# Altium schematic sheet LoRaUNO_SCH_2022-06-21.schdoc
size 315 x 275 mm
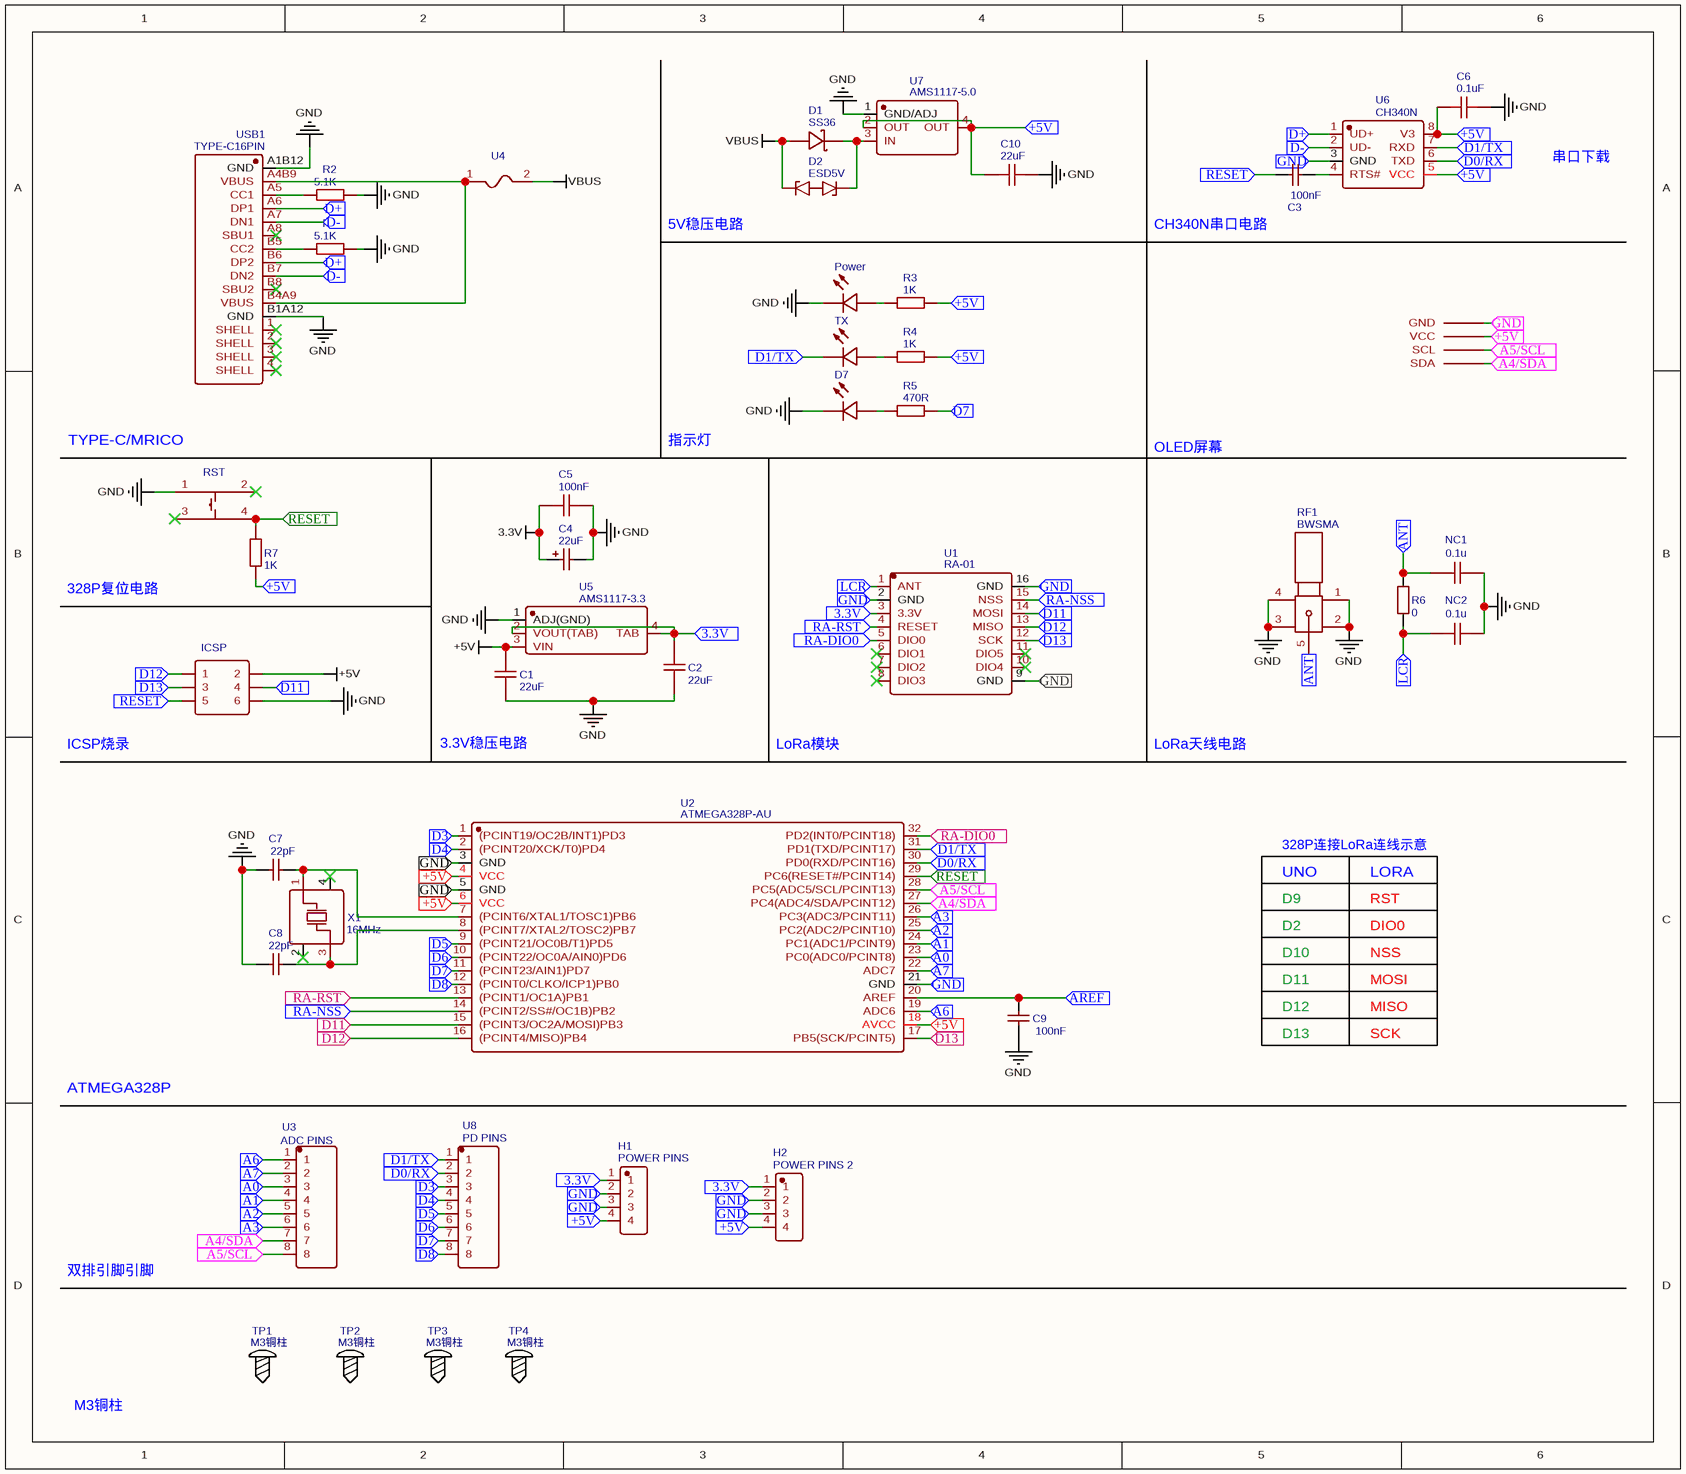
[diagram p0: LoRaUNO_SCH_2022-06-21.schdoc]

## Parts
A1  0.96 OLED  [0.96_I2C_OLED_SSD1306 NO HOLES]  (value not drawn)
C1  22uF  [C0603]
C2  22uF  [C0603]
C3  100nF  [C0603]
C4  22uF  [CAP-SMD_L3.5-W2.8-R-RD]
C5  100nF  [C0603]
C6  0.1uF  [C0603]
C7  22pF  [C0603]
C8  22pF  [C0603]
C9  100nF  [C0603]
C10  22uF  [C0603]
D1  SS36  [SMA_L4.3-W2.6-LS5.2-RD]
D2  ESD5V  [SOD-323_L1.8-W1.3-LS2.5-RD]
H1  POWER PINS  [HDR-TH_4P-P2.54-V-F]
H2  POWER PINS 2  [HDR-TH_4P-P2.54-V-F]
ICSP  Header-Male-2.54_2x3  [HDR-TH_6P-P2.54-V-R2-C3-S2.54]  (value not drawn)
LED1  Power  [LED0603-R-RD]
LED2  TX  [LED0603-R-RD]
LED3  D7  [LED0603-R-RD]
NC1  0.1u  [C0603]
NC2  0.1u  [C0603]
R1  5.1K  [R0603]
R2  5.1K  [R0603]
R3  1K  [R0603]
R4  1K  [R0603]
R5  470R  [R0603]
R6  0  [R0603]
R7  1K  [R0603]
RF1  BWSMA  [SMA-SMD_BWSMA-KE-P001]
RST  SKRPACE010  [KEY-SMD_4P-L4.2-W3.2-P2.20-LS4.6]  (value not drawn)
TP1  M3铜柱  [M3铜柱]
TP2  M3铜柱  [M3铜柱]
TP3  M3铜柱  [M3铜柱]
TP4  M3铜柱  [M3铜柱]
U1  RA-01  [WIRELM-SMD_RA-01]
U2  ATMEGA328P-AU  [TQFP-32_L7.0-W7.0-P0.80-LS9.0-BL]
U3  ADC PINS  [HDR-TH_8P-P2.54-V-M]
U4  MF-PSMF110X-2  [F0805]  (value not drawn)
U5  AMS1117-3.3  [SOT-223_L6.7-W3.5-P2.30-BR]
U6  CH340N  [SOP-8_L5.0-W4.0-P1.27-LS6.0-BL]
U7  AMS1117-5.0  [SOT-223-3_L6.5-W3.4-P2.30-LS7.0-BR]
U8  PD PINS  [HDR-TH_8P-P2.54-V-M]
USB1  TYPE-C16PIN  [USB-C-SMD_TYPE-C16PIN]
X1  16MHz  [OSC-SMD_4P-L3.2-W2.5-BL]

## Ports
3.3V (in), +5V (in), A0 (in), A1 (in), A2 (in), A3 (in), A4/SDA (in), A5/SCL (in), A6 (in), A7 (in), ANT (in), AREF (in), D0/RX (in), D1/TX (in), D3 (in), D4 (in), D5 (in), D6 (in), D7 (in), D8 (in), D11 (in), D12 (in), D13 (in), D+ (in), D- (in), GND (in), LCR (in), RA-DIO0 (in), RA-NSS (in), RA-RST (in), RESET (in)

## Nets
3.3V: C4.1 C5.1
+5V: C1.2 ICSP.2 U5.3(VIN)
GND: C1.1 C2.1 C4.2 C5.2 C6.2 C7.1 C8.1 C9.2 C10.1 ICSP.6 LED1.2 LED3.2 NC1.2 NC2.2 R1.1 R2.1 RF1.1 RF1.2 RF1.3 RF1.4 RST.1 U5.1(ADJ(GND)) U7.1(GND/ADJ) USB1.A1B12(GND) USB1.B1A12(GND)
VBUS: D1.2(A) D2.2 U4.2
3.3V: C2.2 H1.1 H2.1 U1.3(3.3V) U5.2(VOUT(TAB)) U5.4(TAB) ; port 3.3V  [a separate net that carries the same name]
+5V: A1.2(VCC) C6.1 C10.2 H1.4 H2.4 R3.2 R4.2 R7.1 U2.4(VCC) U2.6(VCC) U2.18(AVCC) U6.5(VCC) U6.8(V3) U7.2(OUT) U7.4(OUT) ; port +5V  [a separate net that carries the same name]
A0: U2.23(PC0(ADC0/PCINT8)) U3.3 ; port A0
A1: U2.24(PC1(ADC1/PCINT9)) U3.4 ; port A1
A2: U2.25(PC2(ADC2/PCINT10)) U3.5 ; port A2
A3: U2.26(PC3(ADC3/PCINT11)) U3.6 ; port A3
A4/SDA: A1.4(SDA) U2.27(PC4(ADC4/SDA/PCINT12)) U3.7 ; port A4/SDA
A5/SCL: A1.3(SCL) U2.28(PC5(ADC5/SCL/PCINT13)) U3.8 ; port A5/SCL
A6: U2.19(ADC6) U3.1 ; port A6
A7: U2.22(ADC7) U3.2 ; port A7
ANT: NC1.1 R6.2 RF1.5 ; port ANT
AREF: C9.1 U2.20(AREF) ; port AREF
D0/RX: U2.30(PD0(RXD/PCINT16)) U6.6(TXD) U8.2 ; port D0/RX
D1/TX: LED2.2 U2.31(PD1(TXD/PCINT17)) U6.7(RXD) U8.1 ; port D1/TX
D3: U2.1((PCINT19/OC2B/INT1)PD3) U8.3 ; port D3
D4: U2.2((PCINT20/XCK/T0)PD4) U8.4 ; port D4
D5: U2.9((PCINT21/OC0B/T1)PD5) U8.5 ; port D5
D6: U2.10((PCINT22/OC0A/AIN0)PD6) U8.6 ; port D6
D7: R5.2 U2.11((PCINT23/AIN1)PD7) U8.7 ; port D7
D8: U2.12((PCINT0/CLKO/ICP1)PB0) U8.8 ; port D8
D11: ICSP.4 U1.14(MOSI) U2.15((PCINT3/OC2A/MOSI)PB3) ; port D11
D12: ICSP.1 U1.13(MISO) U2.16((PCINT4/MISO)PB4) ; port D12
D13: ICSP.3 U1.12(SCK) U2.17(PB5(SCK/PCINT5)) ; port D13
D+: U6.1(UD+) USB1.A6(DP1) USB1.B6(DP2) ; port D+
D-: U6.2(UD-) USB1.A7(DN1) USB1.B7(DN2) ; port D-
GND: A1.1(GND) H1.2 H1.3 H2.2 H2.3 U1.2(GND) U1.9(GND) U1.16(GND) U2.3(GND) U2.5(GND) U2.21(GND) U6.3(GND) ; port GND  [a separate net that carries the same name]
LCR: NC2.1 R6.1 U1.1(ANT) ; port LCR
RA-DIO0: U1.5(DIO0) U2.32(PD2(INT0/PCINT18)) ; port RA-DIO0
RA-NSS: U1.15(NSS) U2.14((PCINT2/SS#/OC1B)PB2) ; port RA-NSS
RA-RST: U1.4(RESET) U2.13((PCINT1/OC1A)PB1) ; port RA-RST
RESET: C3.2 ICSP.5 R7.2 RST.4 U2.29(PC6(RESET#/PCINT14)) ; port RESET
NetC3_1: C3.1 U6.4(RTS#)
NetC7_2: C7.2 U2.7((PCINT6/XTAL1/TOSC1)PB6) X1.1(OSC1)
NetC8_2: C8.2 U2.8((PCINT7/XTAL2/TOSC2)PB7) X1.3(OSC2)
NetD1_1: D1.1(K) D2.1 U7.3(IN)
NetLED1_1: LED1.1 R3.1
NetLED2_1: LED2.1 R4.1
NetLED3_1: LED3.1 R5.1
NetR1_2: R1.2 USB1.B5(CC2)
NetR2_2: R2.2 USB1.A5(CC1)
NetU4_1: U4.1 USB1.A4B9(VBUS) USB1.B4A9(VBUS)

Not connected (* = marked no-connect by the designer): RST 2* 3*; U1 6(DIO1)* 7(DIO2)* 8(DIO3)* 10(DIO4)* 11(DIO5)*; USB1 1(SHELL)* 2(SHELL)* 3(SHELL)* 4(SHELL)* A8(SBU1)* B8(SBU2)*; X1 2(GND)* 4(GND)*

## Notes on the sheet
- 串口下载
- 5V稳压电路
- CH340N串口电路
- TYPE-C/MRICO
- 指示灯
- OLED屏幕
- 328P复位电路
- ICSP烧录
- (near C1) 3.3V稳压电路
- LoRa模块
- LoRa天线电路
- UNO
- 328P连接LoRa连线示意
- LORA
- D9
- D2
- D10
- RST
- DIO0
- NSS
- D11
- D12
- MOSI
- MISO
- ATMEGA328P
- D13
- SCK
- 双排引脚引脚
- M3铜柱

## Library data of the parts
A1 = 0.96 OLED: BOM_Manufacturer Part: 0.96寸OLED显示屏12864液晶屏模块IIC口ssd1306单片机oled; Contributor: 自绘原理图符号; BOM_Supplier: EasyEDA; link: https://item.taobao.com/item.htm?spm=a230r.1.14.37.66634ac6tKLyq4&id=565003400812&ns=1&abbucket=12#detail; spicePre: A; spiceSymbolName: 0.96 OLED SSD1306 I2C COPY
C1 C2 C10 = 22uF: BOM_Manufacturer: Murata Electronics; BOM_Manufacturer Part: GRT188R61E106ME13D; nameAlias: Capacitance; Contributor: LCSC; BOM_Supplier: LCSC; BOM_Supplier Part: C697423; spicePre: C; spiceSymbolName: GRT188R61E106ME13D
C3 C9 = 100nF: BOM_Manufacturer Part: CL10C220JB8NNNC; BOM_Manufacturer: SAMSUNG; nameAlias: Capacitance; BOM_Paste Type: base; BOM_Assembly Type: smtWeld; BOM_Supplier: LCSC; BOM_Supplier Part: C1653; spicePre: C; spiceSymbolName: CL10C220JB8NNNC
C4 = 22uF: BOM_Manufacturer: AVX; BOM_Manufacturer Part: TAJB226K016RNJ; nameAlias: Capacitance; BOM_Paste Type: expand; BOM_Assembly Type: smtWeld; BOM_Supplier: LCSC; BOM_Supplier Part: C8020; spicePre: C; spiceSymbolName: TAJB226K016RNJ
C5 = 100nF: BOM_Manufacturer: Murata Electronics; BOM_Manufacturer Part: GRT188R61E106ME13D; nameAlias: Capacitance; Contributor: LCSC; BOM_Supplier: LCSC; BOM_Supplier Part: C697423; spicePre: C; spiceSymbolName: GRT188R61E106ME13D
C6 = 0.1uF: BOM_Manufacturer: Murata Electronics; BOM_Manufacturer Part: GRT188R61E106ME13D; nameAlias: Capacitance; Contributor: LCSC; BOM_Supplier: LCSC; BOM_Supplier Part: C697423; spicePre: C; spiceSymbolName: GRT188R61E106ME13D
C7 C8 = 22pF: BOM_Manufacturer Part: CL10C220JB8NNNC; BOM_Manufacturer: SAMSUNG; nameAlias: Capacitance; BOM_Paste Type: base; BOM_Assembly Type: smtWeld; BOM_Supplier: LCSC; BOM_Supplier Part: C1653; spicePre: C; spiceSymbolName: CL10C220JB8NNNC
D1 = SS36: BOM_Manufacturer: MDD; BOM_Paste Type: expand; BOM_Assembly Type: smtWeld; BOM_Supplier: LCSC; BOM_Manufacturer Part: SS36; image: //image.lceda.cn/szlcsc/C16015.jpg; BOM_Supplier Part: C16015; spicePre: D; spiceSymbolName: SS36
D2 = ESD5V: BOM_Manufacturer: Nexperia; BOM_Manufacturer Part: PESD5V0S1BA,115; BOM_Paste Type: expand; BOM_Assembly Type: smtWeld; BOM_Supplier: LCSC; image: //image.lceda.cn/szlcsc/C19224.jpg; BOM_Supplier Part: C19224; spicePre: D; spiceSymbolName: PESD5V0S1BA,115
H1 = POWER PINS: BOM_Manufacturer: GEPU(歌普); BOM_Manufacturer Part: GP26-2520WV-4P; Contributor: LCSC; BOM_Supplier: LCSC; BOM_Supplier Part: C2681739; spicePre: H; spiceSymbolName: GP26-2520WV-4P
H2 = POWER PINS 2: BOM_Manufacturer: GEPU(歌普); BOM_Manufacturer Part: GP26-2520WV-4P; Contributor: LCSC; BOM_Supplier: LCSC; BOM_Supplier Part: C2681739; spicePre: H; spiceSymbolName: GP26-2520WV-4P
ICSP = Header-Male-2.54_2x3: BOM_Manufacturer: BOOMELE; BOM_Paste Type: expand; BOM_Assembly Type: manualWeld; BOM_Supplier: LCSC; BOM_Manufacturer Part: Header-Male-2.54_2x3; BOM_Supplier Part: C65114; spicePre: J; spiceSymbolName: Header-Male-2.54_2x3
LED1 = Power: BOM_Manufacturer: Everlight Elec; BOM_Manufacturer Part: 19-213/R6W-BP2Q2B/3T; Contributor: LCSC; BOM_Paste Type: expand; BOM_Assembly Type: smtWeld; BOM_Supplier: LCSC; BOM_Supplier Part: C181863; spicePre: L; spiceSymbolName: 19-213/R6W-BP2Q2B/3T
LED2 = TX: BOM_Manufacturer: Everlight Elec; BOM_Manufacturer Part: 19-213/R6W-BP2Q2B/3T; Contributor: LCSC; BOM_Paste Type: expand; BOM_Assembly Type: smtWeld; BOM_Supplier: LCSC; BOM_Supplier Part: C181863; spicePre: L; spiceSymbolName: 19-213/R6W-BP2Q2B/3T
LED3 = D7: BOM_Manufacturer: Everlight Elec; BOM_Manufacturer Part: 19-213/R6W-BP2Q2B/3T; Contributor: LCSC; BOM_Paste Type: expand; BOM_Assembly Type: smtWeld; BOM_Supplier: LCSC; BOM_Supplier Part: C181863; spicePre: L; spiceSymbolName: 19-213/R6W-BP2Q2B/3T
NC1 NC2 = 0.1u: nameAlias: Value(F); Contributor: LCEDA_Lib; spicePre: C; spiceSymbolName: C_0603_US
R1 R2 = 5.1K: BOM_Manufacturer: Tyohm; BOM_Manufacturer Part: RMC06035.1K5%N; nameAlias: Resistance (Ohms); Contributor: LCSC; BOM_Supplier: LCSC; BOM_Supplier Part: C269696; spicePre: R; spiceSymbolName: RMC06035.1K5%N
R3 R4 R7 = 1K: BOM_Manufacturer: Tyohm; BOM_Manufacturer Part: RMC06031K1%N; nameAlias: Resistance (Ohms); Contributor: LCSC; BOM_Supplier: LCSC; BOM_Supplier Part: C269704; spicePre: R; spiceSymbolName: RMC06031K1%N
R5 = 470R: BOM_Manufacturer: Tyohm; BOM_Manufacturer Part: RMC06031K1%N; nameAlias: Resistance (Ohms); Contributor: LCSC; BOM_Supplier: LCSC; BOM_Supplier Part: C269704; spicePre: R; spiceSymbolName: RMC06031K1%N
R6 = 0: BOM_Manufacturer: KOA; BOM_Manufacturer Part: RK73Z1JTTD; nameAlias: Resistance (Ohms); BOM_Supplier: LCSC; BOM_Supplier Part: C130238; spicePre: R; spiceSymbolName: RK73Z1JTTD
RF1 = BWSMA: BOM_Manufacturer: BAT WIRELESS; BOM_Manufacturer Part: BWSMA-KE-P001; Contributor: LCSC; BOM_Supplier: LCSC; BOM_Supplier Part: C496550; spicePre: R; spiceSymbolName: BWSMA-KE-P001
RST = SKRPACE010: BOM_Manufacturer: ALPS; Contributor: LCSC; BOM_Supplier: LCSC; BOM_Manufacturer Part: SKRPACE010; BOM_Supplier Part: C139797; spicePre: S; spiceSymbolName: SKRPACE010
TP1-TP4 = M3铜柱: Contributor: 立创EDA电子小制作; spicePre: T; spiceSymbolName: M3铜柱
U1 = RA-01: BOM_Manufacturer: Ai-Thinker; Contributor: LCSC; BOM_Paste Type: expand; BOM_Assembly Type: smtWeld; BOM_Supplier: LCSC; BOM_Supplier Part: C90040; BOM_Manufacturer Part: Ra-01; spicePre: U; spiceSymbolName: RA-01
U2 = ATMEGA328P-AU: BOM_Manufacturer: MICROCHIP; BOM_Paste Type: base; BOM_Assembly Type: smtWeld; BOM_Supplier: LCSC; BOM_Manufacturer Part: ATMEGA328P-AU; image: //image.lceda.cn/szlcsc/C14877.jpg; BOM_Supplier Part: C14877; spicePre: U; spiceSymbolName: ATMEGA328P-AU
U3 = ADC PINS: BOM_Manufacturer: Nextronics Engineering; BOM_Manufacturer Part: Z-211-0811-0021-001; Contributor: LCSC; BOM_Paste Type: expand; BOM_Assembly Type: manualWeld; BOM_Supplier: LCSC; BOM_Supplier Part: C190820; spicePre: U; spiceSymbolName: Z-211-0811-0021-001
U4 = MF-PSMF110X-2: BOM_Manufacturer: BOURNS; BOM_Paste Type: expand; BOM_Assembly Type: smtWeld; BOM_Supplier: LCSC; BOM_Manufacturer Part: MF-PSMF110X-2; BOM_Supplier Part: C89658; spicePre: U; spiceSymbolName: MF-PSMF110X-2
U5 = AMS1117-3.3: BOM_Manufacturer: Youtai Semiconductor Co., Ltd.; Contributor: LCSC; BOM_Paste Type: expand; BOM_Assembly Type: smtWeld; BOM_Supplier: LCSC; BOM_Supplier Part: C347222; BOM_Manufacturer Part: AMS1117-3.3; spicePre: U; spiceSymbolName: AMS1117-3.3_C347222
U6 = CH340N: BOM_Manufacturer: WCH(Jiangsu Qin Heng); Contributor: LCSC; BOM_Paste Type: expand; BOM_Assembly Type: smtWeld; BOM_Supplier: LCSC; BOM_Supplier Part: C506813; BOM_Manufacturer Part: CH340N; spicePre: U; spiceSymbolName: CH340N
U7 = AMS1117-5.0: BOM_Manufacturer: KEXIN; Contributor: LCSC; BOM_Supplier: LCSC; BOM_Supplier Part: C489390; BOM_Manufacturer Part: AMS1117-5.0; spicePre: U; spiceSymbolName: AMS1117-5.0_C489390
U8 = PD PINS: BOM_Manufacturer: Nextronics Engineering; BOM_Manufacturer Part: Z-211-0811-0021-001; Contributor: LCSC; BOM_Paste Type: expand; BOM_Assembly Type: manualWeld; BOM_Supplier: LCSC; BOM_Supplier Part: C190820; spicePre: U; spiceSymbolName: Z-211-0811-0021-001
USB1 = TYPE-C16PIN: BOM_Manufacturer: SHOU HAN; Contributor: LCSC; BOM_Supplier: LCSC; BOM_Supplier Part: C393939; BOM_Manufacturer Part: TYPE-C16PIN; spicePre: U; spiceSymbolName: TYPE-C16PIN
X1 = 16MHz: BOM_Manufacturer: YXC; BOM_Manufacturer Part: X322516MLB4SI; nameAlias: Frequency; BOM_Paste Type: base; BOM_Assembly Type: smtWeld; BOM_Supplier: LCSC; BOM_Supplier Part: C13738; spicePre: X; spiceSymbolName: X322516MLB4SI